# EAGLE schematic GPS UEXT (EAGLE 9.5.1)
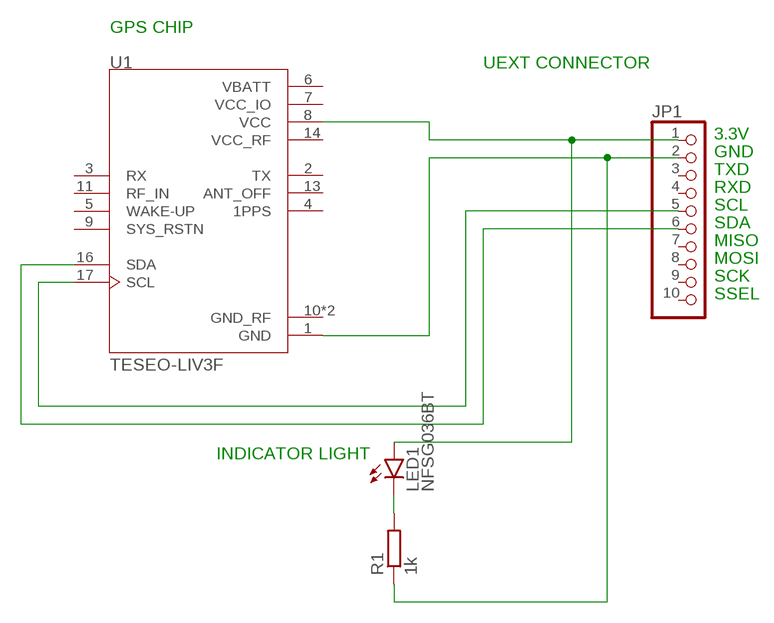
[diagram p0: schematic, sheet 1]

## Parts
JP1  PINHD-1X10/90  [1X10/90]
LED1  NFSG036BT  [NFSG036BT]
R1  1k  R-EU_M1206  [M1206]
U1  TESEO-LIV3F  [TESEO-LIV3F]

## Nets
N$1: JP1.2 R1.1 U1.1(GND)
N$2: JP1.1 LED1.A U1.8(VCC)
N$3: JP1.5 U1.17(SCL)
N$4: JP1.6 U1.16(SDA)
N$5: LED1.C R1.2
Unconnected: JP1.3 JP1.4 JP1.7 JP1.8 JP1.9 JP1.10 U1.2(TX) U1.3(RX) U1.4(1PPS) U1.5(WAKE-UP) U1.9(SYS_RSTN) U1.11(RF_IN) U1.13(ANT_OFF)

## Notes on the sheet
- GPS CHIP
- UEXT CONNECTOR
- 3.3V
- GND
- TXD
- RXD
- SCL
- SDA
- MISO
- MOSI
- SCK
- SSEL
- INDICATOR LIGHT

## Power pins joined to a net without a drawn wire
GND_RF: U1.10(GND_RF) U1.12(GND_RF)
VBATT: U1.6(VBATT)
VCC_IO: U1.7(VCC_IO)
VCC_RF: U1.14(VCC_RF)

## Library data of the parts
JP1 = pinhead:PINHD-1X10: PIN HEADER
LED1 = led:NFSG036BT: CHIP TYPE GREEN LED NFSx036xT Source: NICHIA CORPORATION .. NFSG036BT-E.pdf
R1 = rcl:R-EU_: RESISTOR, European symbol; SPICEPREFIX: R
U1 = TESEO-LIV3F:TESEO-LIV3F: Link: https://www.st.com/en/positioning/teseo-liv3f.html; AVAILABILITY: Unavailable; DESCRIPTION: - RF Receiver BeiDou, Galileo, GLONASS, GNSS, GPS 1.575GHz -163dBm 18-LCC _9.7x10.1_; MF: STMicroelectronics; MP: TESEO-LIV3F; PACKAGE: SMD-18 STMicroelectronics; PRICE: None